# EAGLE design MIDI-Patchbay-Simple (EAGLE 7.6.0)
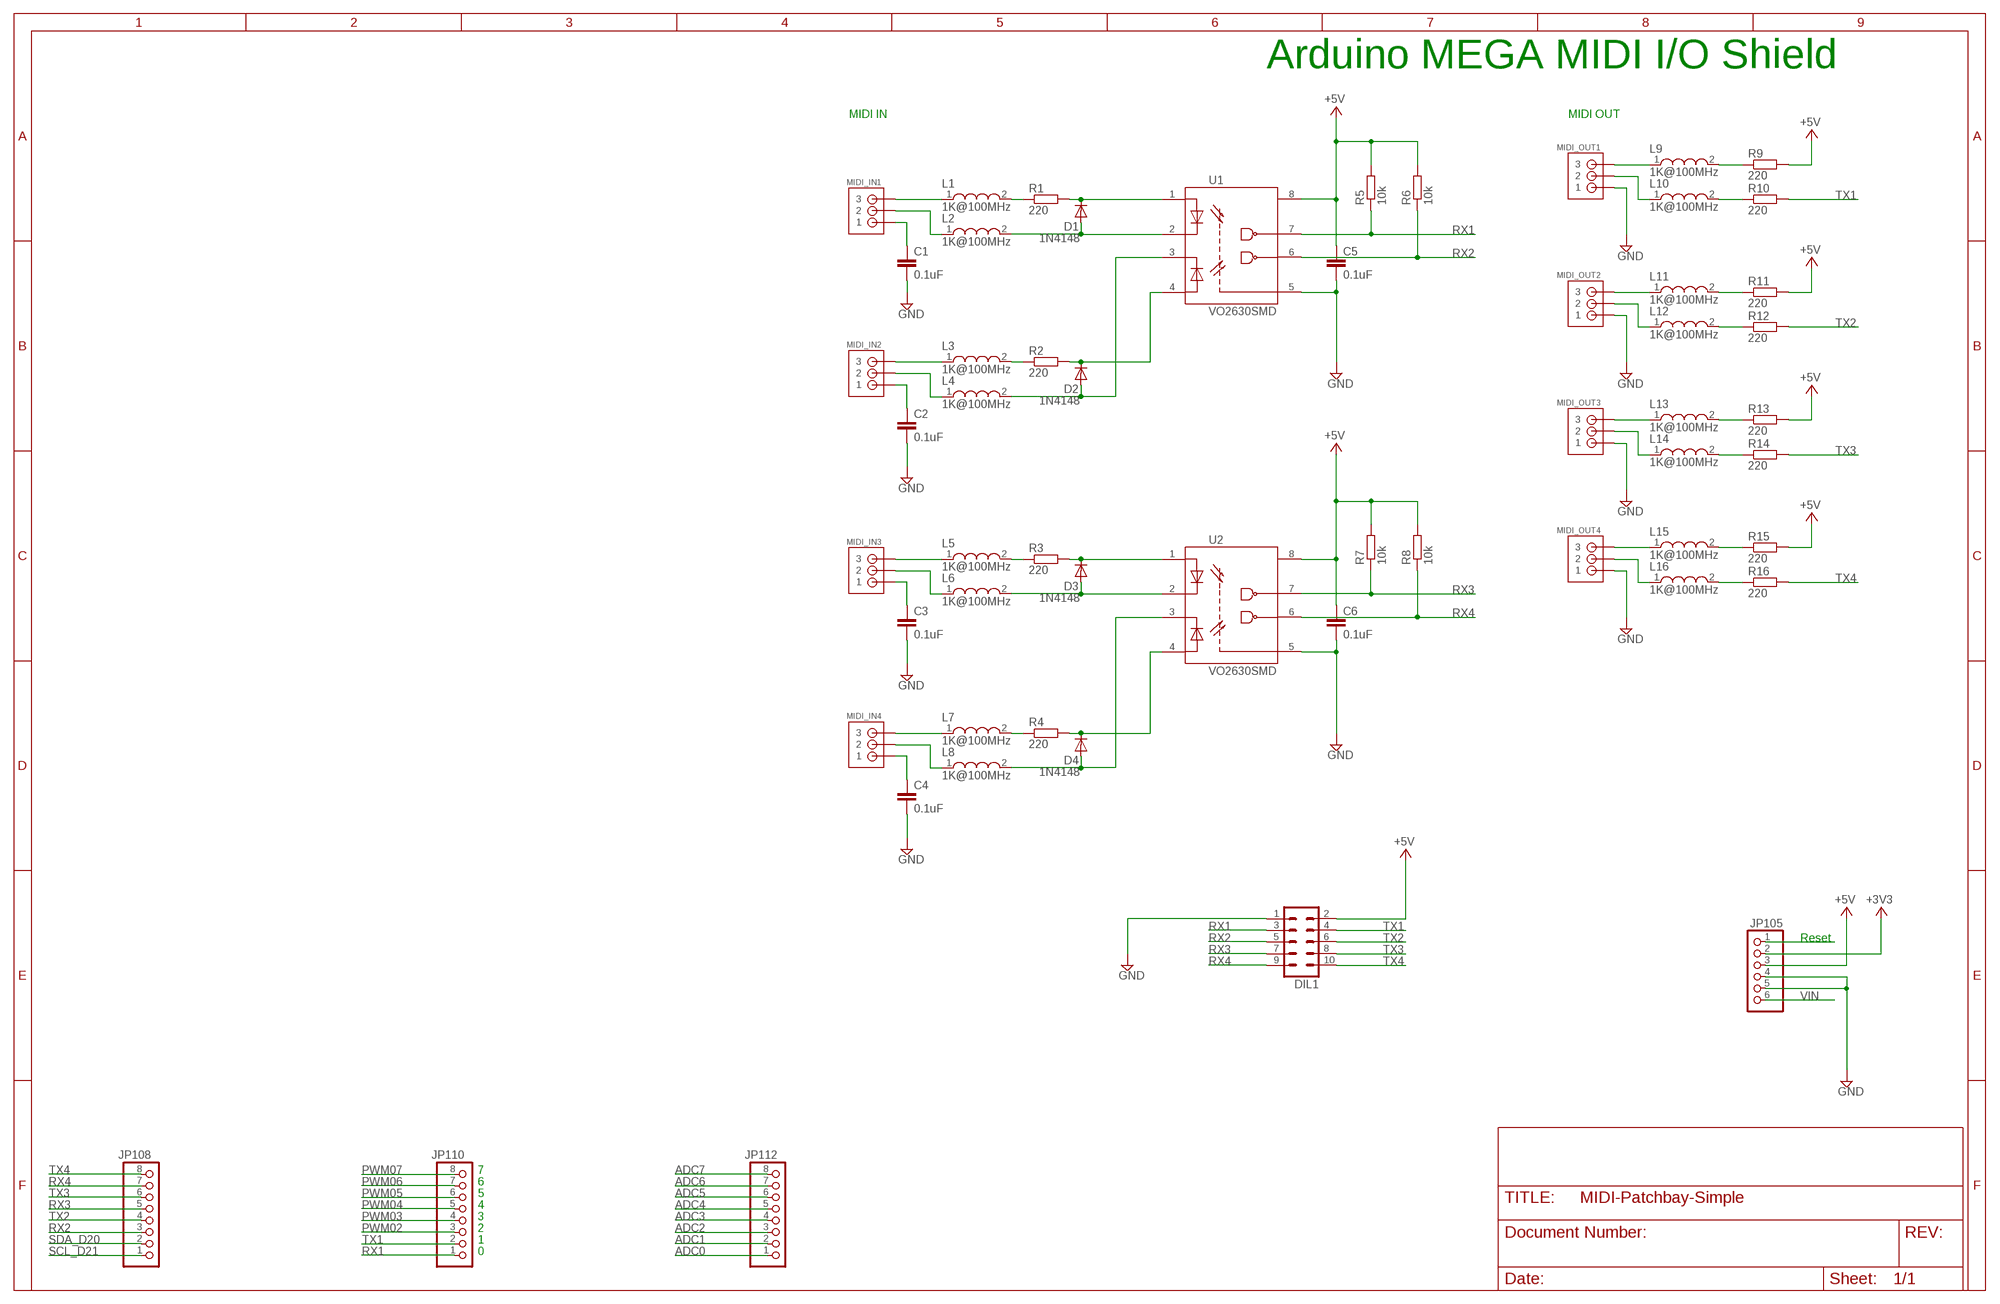
[diagram p0: schematic, sheet 1]

## Parts
C1  0.1uF  CAP0805  [0805]
C2  0.1uF  CAP0805  [0805]
C3  0.1uF  CAP0805  [0805]
C4  0.1uF  CAP0805  [0805]
C5  0.1uF  C-EUC0805  [C0805]
C6  0.1uF  C-EUC0805  [C0805]
D1  1N4148  [SOD323-W]
D2  1N4148  [SOD323-W]
D3  1N4148  [SOD323-W]
D4  1N4148  [SOD323-W]
DIL1  ML10  [ML10]
JP105  PINHD-1X6  [1X06]
JP108  PINHD-1X8  [1X08]
JP110  PINHD-1X8  [1X08]
JP112  PINHD-1X8  [1X08]
L1  1K@100MHz  WE-RFI_0805  [WE-RFI_0805]
L2  1K@100MHz  WE-RFI_0805  [WE-RFI_0805]
L3  1K@100MHz  WE-RFI_0805  [WE-RFI_0805]
L4  1K@100MHz  WE-RFI_0805  [WE-RFI_0805]
L5  1K@100MHz  WE-RFI_0805  [WE-RFI_0805]
L6  1K@100MHz  WE-RFI_0805  [WE-RFI_0805]
L7  1K@100MHz  WE-RFI_0805  [WE-RFI_0805]
L8  1K@100MHz  WE-RFI_0805  [WE-RFI_0805]
L9  1K@100MHz  WE-RFI_0805  [WE-RFI_0805]
L10  1K@100MHz  WE-RFI_0805  [WE-RFI_0805]
L11  1K@100MHz  WE-RFI_0805  [WE-RFI_0805]
L12  1K@100MHz  WE-RFI_0805  [WE-RFI_0805]
L13  1K@100MHz  WE-RFI_0805  [WE-RFI_0805]
L14  1K@100MHz  WE-RFI_0805  [WE-RFI_0805]
L15  1K@100MHz  WE-RFI_0805  [WE-RFI_0805]
L16  1K@100MHz  WE-RFI_0805  [WE-RFI_0805]
MIDI_IN1  JST-XA-03-PIN  [JST-XA-03]
MIDI_IN2  JST-XA-03-PIN  [JST-XA-03]
MIDI_IN3  JST-XA-03-PIN  [JST-XA-03]
MIDI_IN4  JST-XA-03-PIN  [JST-XA-03]
MIDI_OUT1  JST-XA-03-PIN  [JST-XA-03]
MIDI_OUT2  JST-XA-03-PIN  [JST-XA-03]
MIDI_OUT3  JST-XA-03-PIN  [JST-XA-03]
MIDI_OUT4  JST-XA-03-PIN  [JST-XA-03]
R1  220  R-EU_M0805  [M0805]
R2  220  R-EU_M0805  [M0805]
R3  220  R-EU_M0805  [M0805]
R4  220  R-EU_M0805  [M0805]
R5  10k  R-EU_R0805  [R0805]
R6  10k  R-EU_R0805  [R0805]
R7  10k  R-EU_R0805  [R0805]
R8  10k  R-EU_R0805  [R0805]
R9  220  R-EU_M0805  [M0805]
R10  220  R-EU_M0805  [M0805]
R11  220  R-EU_M0805  [M0805]
R12  220  R-EU_M0805  [M0805]
R13  220  R-EU_M0805  [M0805]
R14  220  R-EU_M0805  [M0805]
R15  220  R-EU_M0805  [M0805]
R16  220  R-EU_M0805  [M0805]
U1  VO2630SMD  [SOIC254P1030X390-8N]
U2  VO2630SMD  [SOIC254P1030X390-8N]

## Nets
+3V3 [power]: JP105.2
+5V [power]: C5.1 C6.1 DIL1.2 JP105.3 R5.2 R6.2 R7.2 R8.2 R9.2 R11.2 R13.2 R15.2 U1.8(VCC) U2.8(VCC)
ADC0: JP112.1
ADC1: JP112.2
ADC2: JP112.3
ADC3: JP112.4
ADC4: JP112.5
ADC5: JP112.6
ADC6: JP112.7
ADC7: JP112.8
GND [gnd]: C1.2 C2.2 C3.2 C4.2 C5.2 C6.2 DIL1.1 JP105.4 JP105.5 MIDI_OUT1.1 MIDI_OUT2.1 MIDI_OUT3.1 MIDI_OUT4.1 U1.5(GND) U2.5(GND)
IC1: D1.C R1.2 U1.1(A1)
IC2: D2.C R2.2 U1.4(A2)
IC3: D3.C R3.2 U2.1(A1)
IC4: D4.C R4.2 U2.4(A2)
N$1: L1.1 MIDI_IN1.3
N$2: L2.1 MIDI_IN1.2
N$3: C1.1 MIDI_IN1.1
N$4: L1.2 R1.1
N$5: L9.1 MIDI_OUT1.3
N$6: D1.A L2.2 U1.2(C1)
N$7: L10.1 MIDI_OUT1.2
N$8: L9.2 R9.1
N$9: L10.2 R10.1
N$10: L3.1 MIDI_IN2.3
N$11: L4.1 MIDI_IN2.2
N$12: L3.2 R2.1
N$13: D2.A L4.2 U1.3(C2)
N$14: C2.1 MIDI_IN2.1
N$15: L5.1 MIDI_IN3.3
N$16: L6.1 MIDI_IN3.2
N$17: L5.2 R3.1
N$18: D3.A L6.2 U2.2(C1)
N$19: C3.1 MIDI_IN3.1
N$20: L7.1 MIDI_IN4.3
N$21: L8.1 MIDI_IN4.2
N$22: L7.2 R4.1
N$23: D4.A L8.2 U2.3(C2)
N$24: C4.1 MIDI_IN4.1
N$25: L11.1 MIDI_OUT2.3
N$26: L12.1 MIDI_OUT2.2
N$27: L11.2 R11.1
N$28: L12.2 R12.1
N$29: L13.1 MIDI_OUT3.3
N$30: L14.1 MIDI_OUT3.2
N$31: L13.2 R13.1
N$32: L14.2 R14.1
N$33: L15.1 MIDI_OUT4.3
N$34: L16.1 MIDI_OUT4.2
N$35: L15.2 R15.1
N$36: L16.2 R16.1
PWM02: JP110.3
PWM03: JP110.4
PWM04: JP110.5
PWM05: JP110.6
PWM06: JP110.7
PWM07: JP110.8
RESET: JP105.1
RX1: DIL1.3 JP110.1 R5.1 U1.7(VO1)
RX2: DIL1.5 JP108.3 R6.1 U1.6(VO2)
RX3: DIL1.7 JP108.5 R7.1 U2.7(VO1)
RX4: DIL1.9 JP108.7 R8.1 U2.6(VO2)
SCL_D21: JP108.1
SDA_D20: JP108.2
TX1: DIL1.4 JP110.2 R10.2
TX2: DIL1.6 JP108.4 R12.2
TX3: DIL1.8 JP108.6 R14.2
TX4: DIL1.10 JP108.8 R16.2
VIN [power]: JP105.6

## Notes on the sheet
- Arduino MEGA MIDI I/O Shield
- MIDI IN | MIDI OUT
- Reset
- 7
- 6
- 5
- 4
- 3
- 2
- 1
- 0

## Library data of the parts
C1-C4 = SparkFun-Capacitors:CAP: Capacitor Standard 0603 ceramic capacitor, and 0.1" leaded capacitor.
C5 C6 = rcl:C-EU: CAPACITOR, European symbol
D1-D4 = abw:1N4148: DIODE high speed (Philips)
DIL1 = con-ml:ML10: HARTING; OC_FARNELL: unknown; OC_NEWARK: unknown
JP105 = pinhead:PINHD-1X6: PIN HEADER
JP108 JP110 JP112 = pinhead:PINHD-1X8: PIN HEADER
L1-L16 = EagleLibrary_Wuerth_Elektronik_eiSos_rev16a:WE-RFI: Ferrite SMD Inductor Characteristics High thermal stability Operating temperature: –40 °C to +85 °C Applications Especially developed for RF applications RFID Low frequency radio applications (Keyless) <http://katalog.we-online.de/media/images/eisos/RfRFI_pf2.jpg> Details see: http://katalog.we-online.de/en/pbs/WE-RFI? Updated by Dan Xu 2014-07-08 2014 (C) Wurth Elektronik
MIDI_IN1-MIDI_IN4 MIDI_OUT1-MIDI_OUT4 = abw:JST-XA-03-PIN: JST XA Connector 3 Pin Wire to board connector. Pitch: 2.54 mm, (0.100") Number of pins: 3
R1-R16 = resistor:R-EU_: RESISTOR, European symbol
U1 U2 = abw:VO2630

## Module MIDI_IN
Ports: 

### Library data of the parts

## Net classes
0 default: width 0.203 mm, drill 0.406 mm, clearance 0.203 mm
1 power: width 0.61 mm, drill 0.711 mm, clearance 0.203 mm
2 gnd: width 0.305 mm, drill 0.711 mm, clearance 0.203 mm
3 usbvcc: width 0.508 mm, drill 0.711 mm, clearance 0.203 mm

## Board
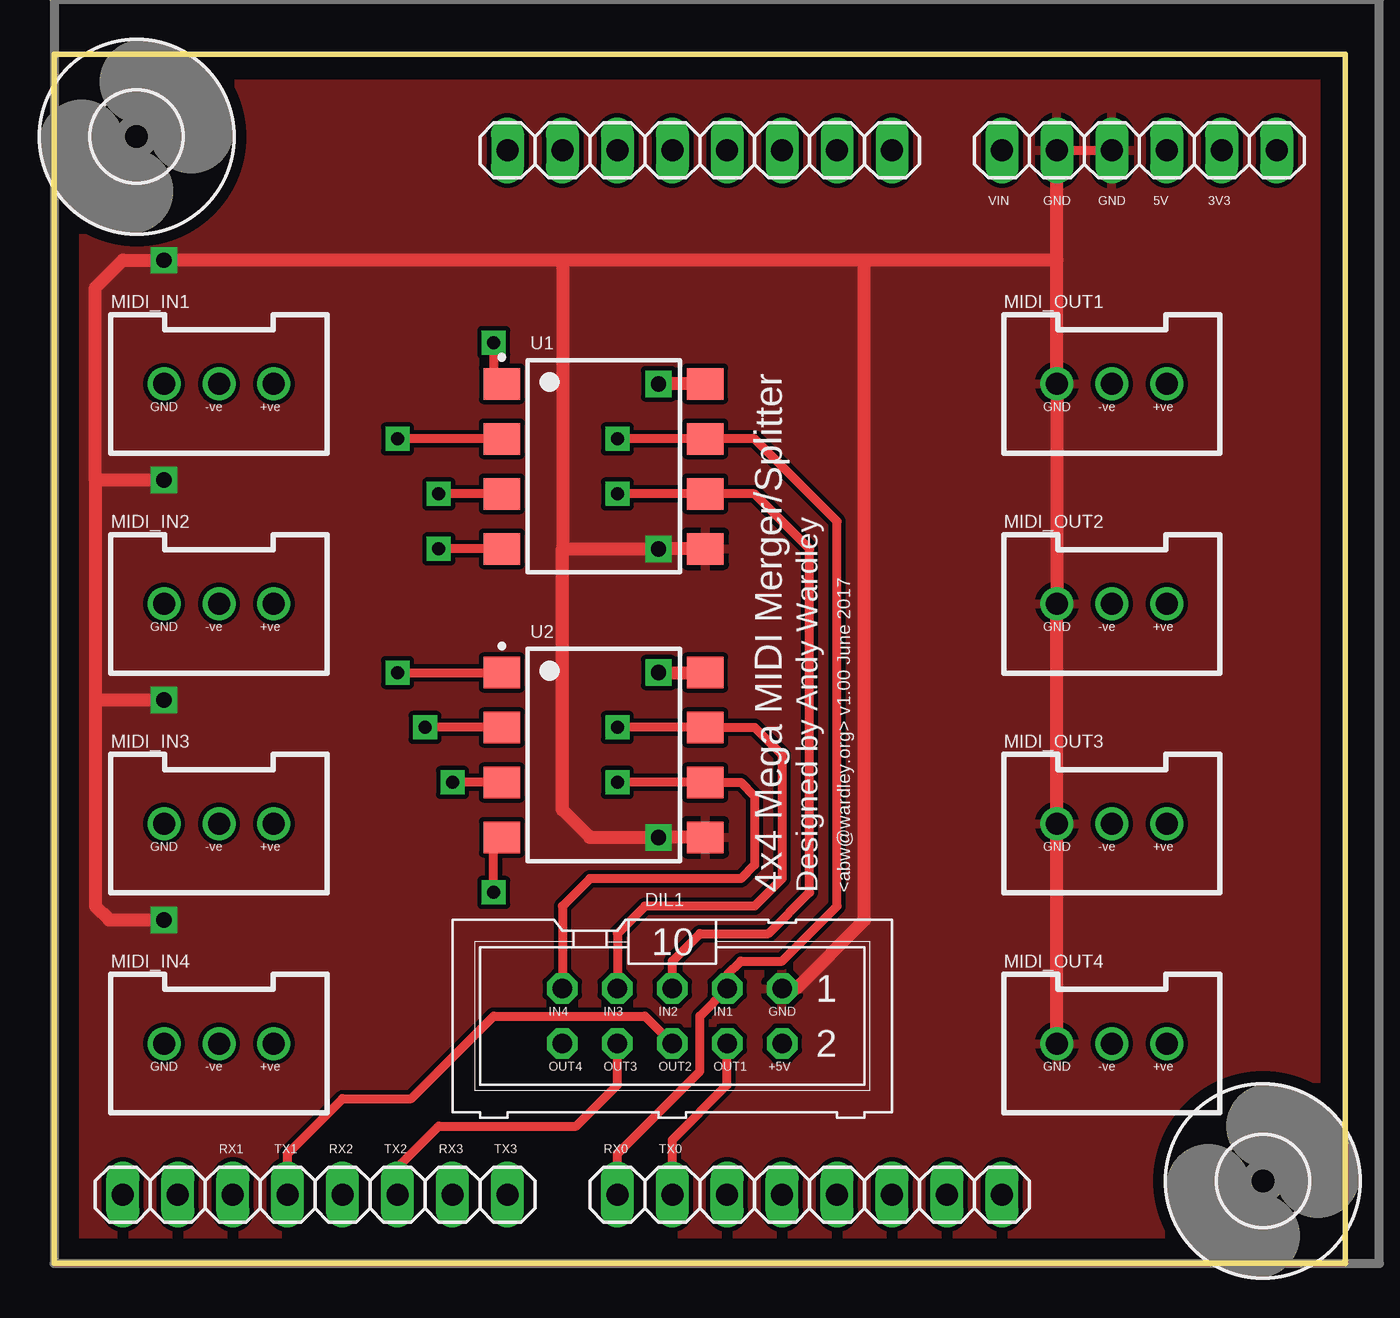
[diagram p1: board, top side]
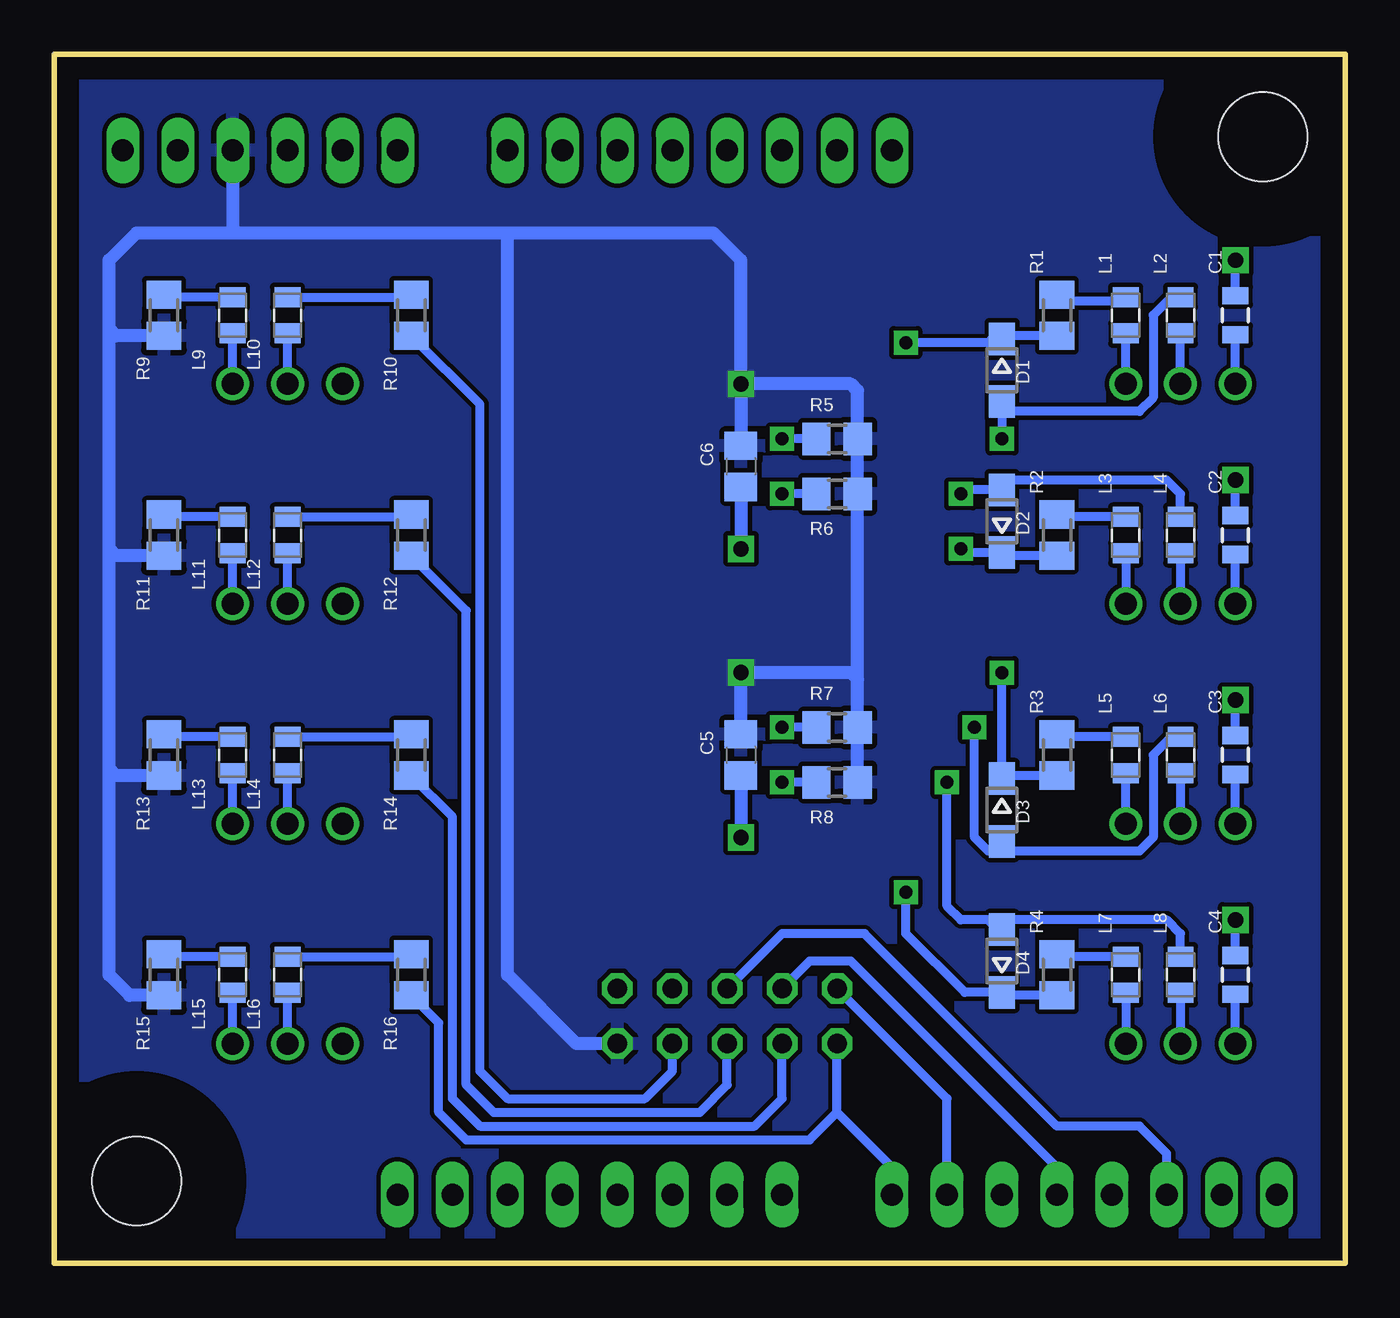
[diagram p2: board, bottom side, seen from below]

Size 59.69 x 55.88 mm. Coordinates in mm from the lower left corner, seen from the top.
Outline: 59.69,0 0,0 0,55.88 59.69,55.88 59.69,0
Copper layers (1*16): Top 0.035mm / dielectric 1.5mm / Bottom 0.035mm
Design rules "default *": minimum track width 8mil, minimum drill 16mil, track to track 8mil, track to pad 8mil, pad to pad 8mil, via to via 10mil, smd to smd 8mil, copper to edge 40mil, drill to drill 12mil, minimum pad ring 10mil, minimum via ring 10mil, stop-mask expansion 4mil, vias tented up to drill 0mil, thermal gap 10mil

### Footprints (pad centres in the part's own frame; a part is rotated, then mirrored left to right if it is on the bottom)
0805 = smd 0.8 x 1.2: 1 -0.9,0; 2 0.9,0
C0805 = smd 1.3 x 1.5: 1 -0.95,0; 2 0.95,0
SOD323-W = smd 1.5 x 1.2: A 1.45,0; C -1.45,0
ML10 = drill 0.914 octagon: 1 -5.08,-1.27; 2 -5.08,1.27; 3 -2.54,-1.27; 4 -2.54,1.27; 5 0,-1.27; 6 0,1.27; 7 2.54,-1.27; 8 2.54,1.27; 9 5.08,-1.27; 10 5.08,1.27
1X06 = drill 1.016 long: 1 -6.35,0; 2 -3.81,0; 3 -1.27,0; 4 1.27,0; 5 3.81,0; 6 6.35,0
1X08 = drill 1.016 long: 1 -8.89,0; 2 -6.35,0; 3 -3.81,0; 4 -1.27,0; 5 1.27,0; 6 3.81,0; 7 6.35,0; 8 8.89,0
WE-RFI_0805 = smd 0.925 x 1.2: 1 -0.838,0; 2 0.838,0
JST-XA-03 = drill 1.016: 1 -2.54,0; 2 0,0; 3 2.54,0
M0805 = smd 1.3 x 1.6: 1 -0.95,0; 2 0.95,0
R0805 = smd 1.3 x 1.5: 1 -0.95,0; 2 0.95,0
SOIC254P1030X390-8N = smd 1.7 x 1.45: 1 -4.7,3.81; 2 -4.7,1.27; 3 -4.7,-1.27; 4 -4.7,-3.81; 5 4.7,-3.81; 6 4.7,-1.27; 7 4.7,1.27; 8 4.7,3.81
4,1 = hole 4.1: 0,0

### Placement (x,y rotation side)
C1  5.08,43.81 90 bottom
C2  5.08,33.66 90 bottom
C3  5.08,23.5 90 bottom
C4  5.08,13.34 90 bottom
C5  27.94,23.5 270 bottom
C6  27.94,36.83 270 bottom
D1  15.88,41.27 270 bottom
D2  15.88,34.29 90 bottom
D3  15.88,20.95 270 bottom
D4  15.88,13.97 90 bottom
DIL1  28.57,11.43 180 top
JP105  50.16,51.44 180 top
JP108  12.06,3.17 0 top
JP110  34.92,3.17 0 top
JP112  29.84,51.44 180 top
L1  10.16,43.81 90 bottom
L2  7.62,43.81 90 bottom
L3  10.16,33.66 90 bottom
L4  7.62,33.66 90 bottom
L5  10.16,23.5 90 bottom
L6  7.62,23.5 90 bottom
L7  10.16,13.34 90 bottom
L8  7.62,13.34 90 bottom
L9  51.44,43.81 90 bottom
L10  48.9,43.81 90 bottom
L11  51.44,33.66 90 bottom
L12  48.9,33.66 90 bottom
L13  51.44,23.5 90 bottom
L14  48.9,23.5 90 bottom
L15  51.44,13.34 90 bottom
L16  48.9,13.34 90 bottom
MIDI_IN1  7.62,40.64 0 top
MIDI_IN2  7.62,30.48 0 top
MIDI_IN3  7.62,20.32 0 top
MIDI_IN4  7.62,10.16 0 top
MIDI_OUT1  48.9,40.64 0 top
MIDI_OUT2  48.9,30.48 0 top
MIDI_OUT3  48.9,20.32 0 top
MIDI_OUT4  48.9,10.16 0 top
R1  13.34,43.81 270 bottom
R2  13.34,33.66 270 bottom
R3  13.34,23.5 270 bottom
R4  13.34,13.34 270 bottom
R5  23.5,38.1 0 bottom
R6  23.5,35.56 0 bottom
R7  23.5,24.77 0 bottom
R8  23.5,22.23 0 bottom
R9  54.61,43.81 270 bottom
R10  43.18,43.81 270 bottom
R11  54.61,33.66 270 bottom
R12  43.18,33.66 270 bottom
R13  54.61,23.5 270 bottom
R14  43.18,23.5 270 bottom
R15  54.61,13.34 270 bottom
R16  43.18,13.34 270 bottom
U1  25.4,36.83 0 top
U2  25.4,23.5 0 top
U$1  [4,1]  3.81,52.07 0 top
U$2  [4,1]  55.88,3.81 0 top

### Tracks (layer width: path | path; a pad name or v marks a point on that pad's centre or on a via)
+5V  (via drill 0.71)
  Top 0.61: v27.94,27.3 U2.8 | U1.8 v27.94,40.64
  Bottom 0.61: C5.1 v27.94,27.3 22.86,27.3 22.55,26.99 R7.2 | R8.2 R7.2 | R7.2 R6.2 R5.2 22.55,40.33 22.86,40.64 v27.94,40.64 | JP105.3 51.44,47.62 | 51.44,47.62 55.88,47.62 57.15,46.35 57.15,43.18 | 51.44,47.62 38.73,47.62 | 38.73,47.62 29.21,47.62 27.94,46.35 v27.94,40.64 | R15.2 56.2,12.38 57.15,13.34 57.15,22.86 | 57.15,22.86 57.15,33.02 | 57.15,33.02 57.15,43.18 | R9.2 56.84,42.87 57.15,43.18 | R11.2 56.84,32.7 57.15,33.02 | R13.2 56.84,22.55 57.15,22.86 | DIL1.2 35.56,10.16 38.73,13.34 38.73,47.62 | v27.94,40.64 C6.1
  pour Bottom: 0,54.61 59.69,54.61 59.69,0 0,0
GND  (via drill 0.71)
  Top 0.406: JP105.5 JP105.4
  Top 0.61: U2.5 v27.94,19.68 24.77,19.68 23.5,20.95 23.5,33.02 | 1.91,36.2 1.91,26.04 | 1.91,26.04 1.91,16.51 2.54,15.88 v5.08,15.88 | v5.08,36.2 1.91,36.2 | v5.08,26.04 1.91,26.04 | 1.91,36.2 1.91,45.09 3.17,46.35 v5.08,46.35 23.5,46.35 | 46.35,46.35 37.47,46.35 | 37.47,46.35 23.5,46.35 | 23.5,46.35 23.5,33.02 | 23.5,33.02 v27.94,33.02 U1.5 | MIDI_OUT4.1 MIDI_OUT3.1 MIDI_OUT2.1 MIDI_OUT1.1 46.35,46.35 | 46.35,46.35 JP105.5 | DIL1.1 34.29,12.7 37.47,15.88 37.47,46.35
  Bottom 0.406: C1.2 v5.08,46.35 | C2.2 v5.08,36.2 | C3.2 v5.08,26.04 | C4.2 v5.08,15.88
  Bottom 0.61: C6.2 v27.94,33.02 | C5.2 v27.94,19.68
  pour Top: 0,54.61 0,0 59.69,0 59.69,54.61
IC1  (via drill 0.6)
  Top 0.406: v20.32,42.55 20.32,41.02 U1.1
  Bottom 0.406: R1.2 15.73,42.87 D1.C 16.33,42.73 16.51,42.55 v20.32,42.55
IC2  (via drill 0.6)
  Top 0.406: U1.4 v17.78,33.02
  Bottom 0.406: R2.2 15.74,32.7 D2.C 17.6,32.84 v17.78,33.02
IC3  (via drill 0.6)
  Top 0.406: 20.32,27.68 U2.1 v15.88,27.3
  Bottom 0.406: R3.2 15.73,22.55 D3.C v15.88,27.3
IC4  (via drill 0.6)
  Top 0.406: v20.32,17.14 20.32,19.3 U2.4
  Bottom 0.406: R4.2 15.74,12.38 D4.C 17.6,12.52 20.32,15.24 v20.32,17.14
N$1
  Bottom 0.406: MIDI_IN1.3 L1.1
N$2
  Bottom 0.406: MIDI_IN1.2 L2.1
N$3
  Bottom 0.406: MIDI_IN1.1 C1.1
N$4
  Bottom 0.406: L1.2 10.16,44.45 13.02,44.45 R1.1
N$5
  Bottom 0.406: MIDI_OUT1.3 L9.1
N$6  (via drill 0.6)
  Top 0.406: U1.2 v15.88,38.1
  Bottom 0.406: v15.88,38.1 D1.A 15.42,39.37 9.53,39.37 8.89,40.01 8.89,43.81 8.05,44.65 L2.2
N$7
  Bottom 0.406: MIDI_OUT1.2 L10.1
N$8
  Bottom 0.406: L9.2 54.5,44.65 R9.1
N$9
  Bottom 0.406: L10.2 43.29,44.65 R10.1
N$10
  Bottom 0.406: L3.1 MIDI_IN2.3
N$11
  Bottom 0.406: L4.1 MIDI_IN2.2
N$12
  Bottom 0.406: L3.2 13.22,34.49 R2.1
N$13  (via drill 0.6)
  Top 0.406: U1.3 v17.78,35.56
  Bottom 0.406: L4.2 7.62,35.56 8.26,36.2 15.42,36.2 D2.A 17.6,35.74 v17.78,35.56
N$14
  Bottom 0.406: MIDI_IN2.1 C2.1
N$15
  Bottom 0.406: MIDI_IN3.3 L5.1
N$16
  Bottom 0.406: 7.62,22.86 L6.1 MIDI_IN3.2
N$17
  Bottom 0.406: L5.2 13.22,24.33 R3.1
N$18  (via drill 0.6)
  Top 0.406: U2.2 v17.14,24.77
  Bottom 0.406: L6.2 8.05,24.33 8.89,23.5 8.89,19.68 9.53,19.05 15.42,19.05 D3.A 16.05,19.5 16.51,19.05 17.14,19.68 v17.14,24.77
N$19
  Bottom 0.406: MIDI_IN3.1 C3.1
N$20
  Bottom 0.406: L7.1 MIDI_IN4.3
N$21
  Bottom 0.406: L8.1 MIDI_IN4.2
N$22
  Bottom 0.406: L7.2 13.22,14.17 R4.1
N$23  (via drill 0.6)
  Top 0.406: U2.3 v18.41,22.23
  Bottom 0.406: L8.2 7.62,15.24 8.26,15.88 15.42,15.88 D4.A 16.05,15.42 16.51,15.88 17.78,15.88 18.41,16.51 v18.41,22.23
N$24
  Bottom 0.406: MIDI_IN4.1 C4.1
N$25
  Bottom 0.406: MIDI_OUT2.3 L11.1
N$26
  Bottom 0.406: MIDI_OUT2.2 L12.1
N$27
  Bottom 0.406: L11.2 54.5,34.49 R11.1
N$28
  Bottom 0.406: L12.2 43.29,34.49 R12.1
N$29
  Bottom 0.406: MIDI_OUT3.3 L13.1
N$30
  Bottom 0.406: MIDI_OUT3.2 L14.1
N$31
  Bottom 0.406: L13.2 54.5,24.33 R13.1
N$32
  Bottom 0.406: L14.2 43.29,24.33 R14.1
N$33
  Bottom 0.406: MIDI_OUT4.3 L15.1
N$34
  Bottom 0.406: MIDI_OUT4.2 L16.1
N$35
  Bottom 0.406: L15.2 54.5,14.17 R15.1
N$36
  Bottom 0.406: L16.2 43.29,14.17 R16.1
RX1  (via drill 0.6)
  Top 0.406: v26.04,38.1 U1.7 32.38,38.1 36.2,34.29 36.2,16.51 33.66,13.97 31.75,13.97 31.11,13.34 DIL1.3 29.84,11.43 29.84,8.89 26.04,5.08 JP110.1
  Bottom 0.406: R5.1 v26.04,38.1
RX2  (via drill 0.6)
  Top 0.406: v26.04,35.56 U1.6 32.38,35.56 34.92,33.02 34.92,17.14 33.02,15.24 29.84,15.24 28.57,13.97 DIL1.5
  Bottom 0.406: R6.1 v26.04,35.56 | JP108.3 8.26,5.08 9.53,6.35 13.34,6.35 22.23,15.24 26.04,15.24 DIL1.5
RX3  (via drill 0.6)
  Top 0.406: v26.04,24.77 U2.7 32.38,24.77 33.66,23.5 33.66,17.78 32.38,16.51 27.3,16.51 26.04,15.24 DIL1.7
  Bottom 0.406: R7.1 v26.04,24.77 | JP108.5 13.34,4.45 22.86,13.97 24.77,13.97 DIL1.7
RX4  (via drill 0.6)
  Top 0.406: v26.04,22.23 U2.6 31.75,22.23 32.38,21.59 32.38,18.41 31.75,17.78 24.77,17.78 23.5,16.51 DIL1.9
  Bottom 0.406: R8.1 v26.04,22.23 | JP108.7 18.41,7.62 DIL1.9
TX1
  Top 0.406: JP110.2 28.57,5.71 31.11,8.26 DIL1.4
  Bottom 0.406: DIL1.4 31.11,8.89 32.38,7.62 38.73,7.62 40.01,8.89 40.01,39.69 R10.2
TX2
  Top 0.406: JP108.4 10.79,5.08 13.34,7.62 16.51,7.62 20.32,11.43 27.3,11.43 DIL1.6
  Bottom 0.406: DIL1.6 28.57,8.26 29.84,6.99 39.37,6.99 40.64,8.26 40.64,30.16 R12.2
TX3
  Top 0.406: JP108.6 15.88,4.45 17.78,6.35 24.13,6.35 26.04,8.26 DIL1.8
  Bottom 0.406: DIL1.8 26.04,7.62 27.3,6.35 40.01,6.35 41.27,7.62 41.27,20.64 R14.2
TX4
  Bottom 0.406: 23.5,6.99 24.77,5.71 40.64,5.71 41.91,6.99 41.91,11.12 R16.2 | 23.5,6.99 DIL1.10 | JP108.8 20.95,4.45 23.5,6.99

### Text on the board
tNames: VIN | GND | GND | 5V | 3V3 | GND | -ve | +ve | GND | -ve | +ve | GND | -ve | +ve | GND | -ve | +ve | GND | -ve | +ve | GND | -ve | +ve | 4x4 Mega MIDI Merger/Splitter | Designed by Andy Wardley | <abw@wardley.org> v1.00 June 2017 | IN4 | IN3 | IN2 | IN1 | GND | GND | -ve | +ve | OUT4 | OUT3 | OUT2 | OUT1 | +5V | GND | -ve | +ve | RX1 | TX1 | RX2 | TX2 | RX3 | TX3 | RX0 | TX0